# EAGLE schematic attiny_x4 (EAGLE 9.2.2)
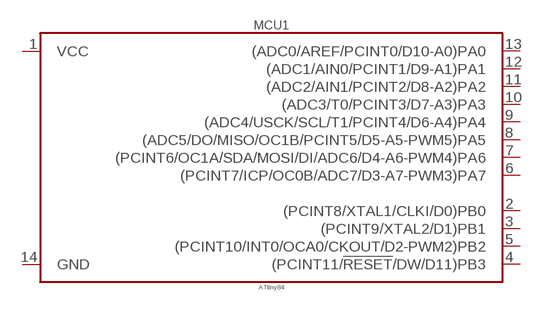
[diagram p0: schematic, sheet 1]

## Parts
MCU1  ATtiny84  ATTINY-X4_DIP-14_ATTINY-84  [DIP793W45P254L1919H533Q14B_DIP-14_ATTINY-X4]
Unconnected: MCU1.1(VCC) MCU1.2((PCINT8/XTAL1/CLKI/D0)PB0) MCU1.3((PCINT9/XTAL2/D1)PB1) MCU1.4((PCINT11/!RESET!/DW/D11)PB3) MCU1.5((PCINT10/INT0/OCA0/CKOUT/D2-PWM2)PB2) MCU1.6((PCINT7/ICP/OC0B/ADC7/D3-A7-PWM3)PA7) MCU1.7((PCINT6/OC1A/SDA/MOSI/DI/ADC6/D4-A6-PWM4)PA6) MCU1.8((ADC5/DO/MISO/OC1B/PCINT5/D5-A5-PWM5)PA5) MCU1.9((ADC4/USCK/SCL/T1/PCINT4/D6-A4)PA4) MCU1.10((ADC3/T0/PCINT3/D7-A3)PA3) MCU1.11((ADC2/AIN1/PCINT2/D8-A2)PA2) MCU1.12((ADC1/AIN0/PCINT1/D9-A1)PA1) MCU1.13((ADC0/AREF/PCINT0/D10-A0)PA0) MCU1.14(GND)

## Library data of the parts
MCU1 = PiB_ic_microcontrollers:ATTINY-X4; DATASHEET: http://www.microchip.com/mymicrochip/filehandler.aspx?ddocname=en590190; DIST: Digikey; DISTLINK: https://www.digikey.com/products/en?keywords=ATTINY84A-PU-ND; DISTPN: ATTINY84A-PU-ND; MFR: Microchip Technology; MPN: ATTINY84A-PU